# EAGLE design PLLv3 (EAGLE 5.06)
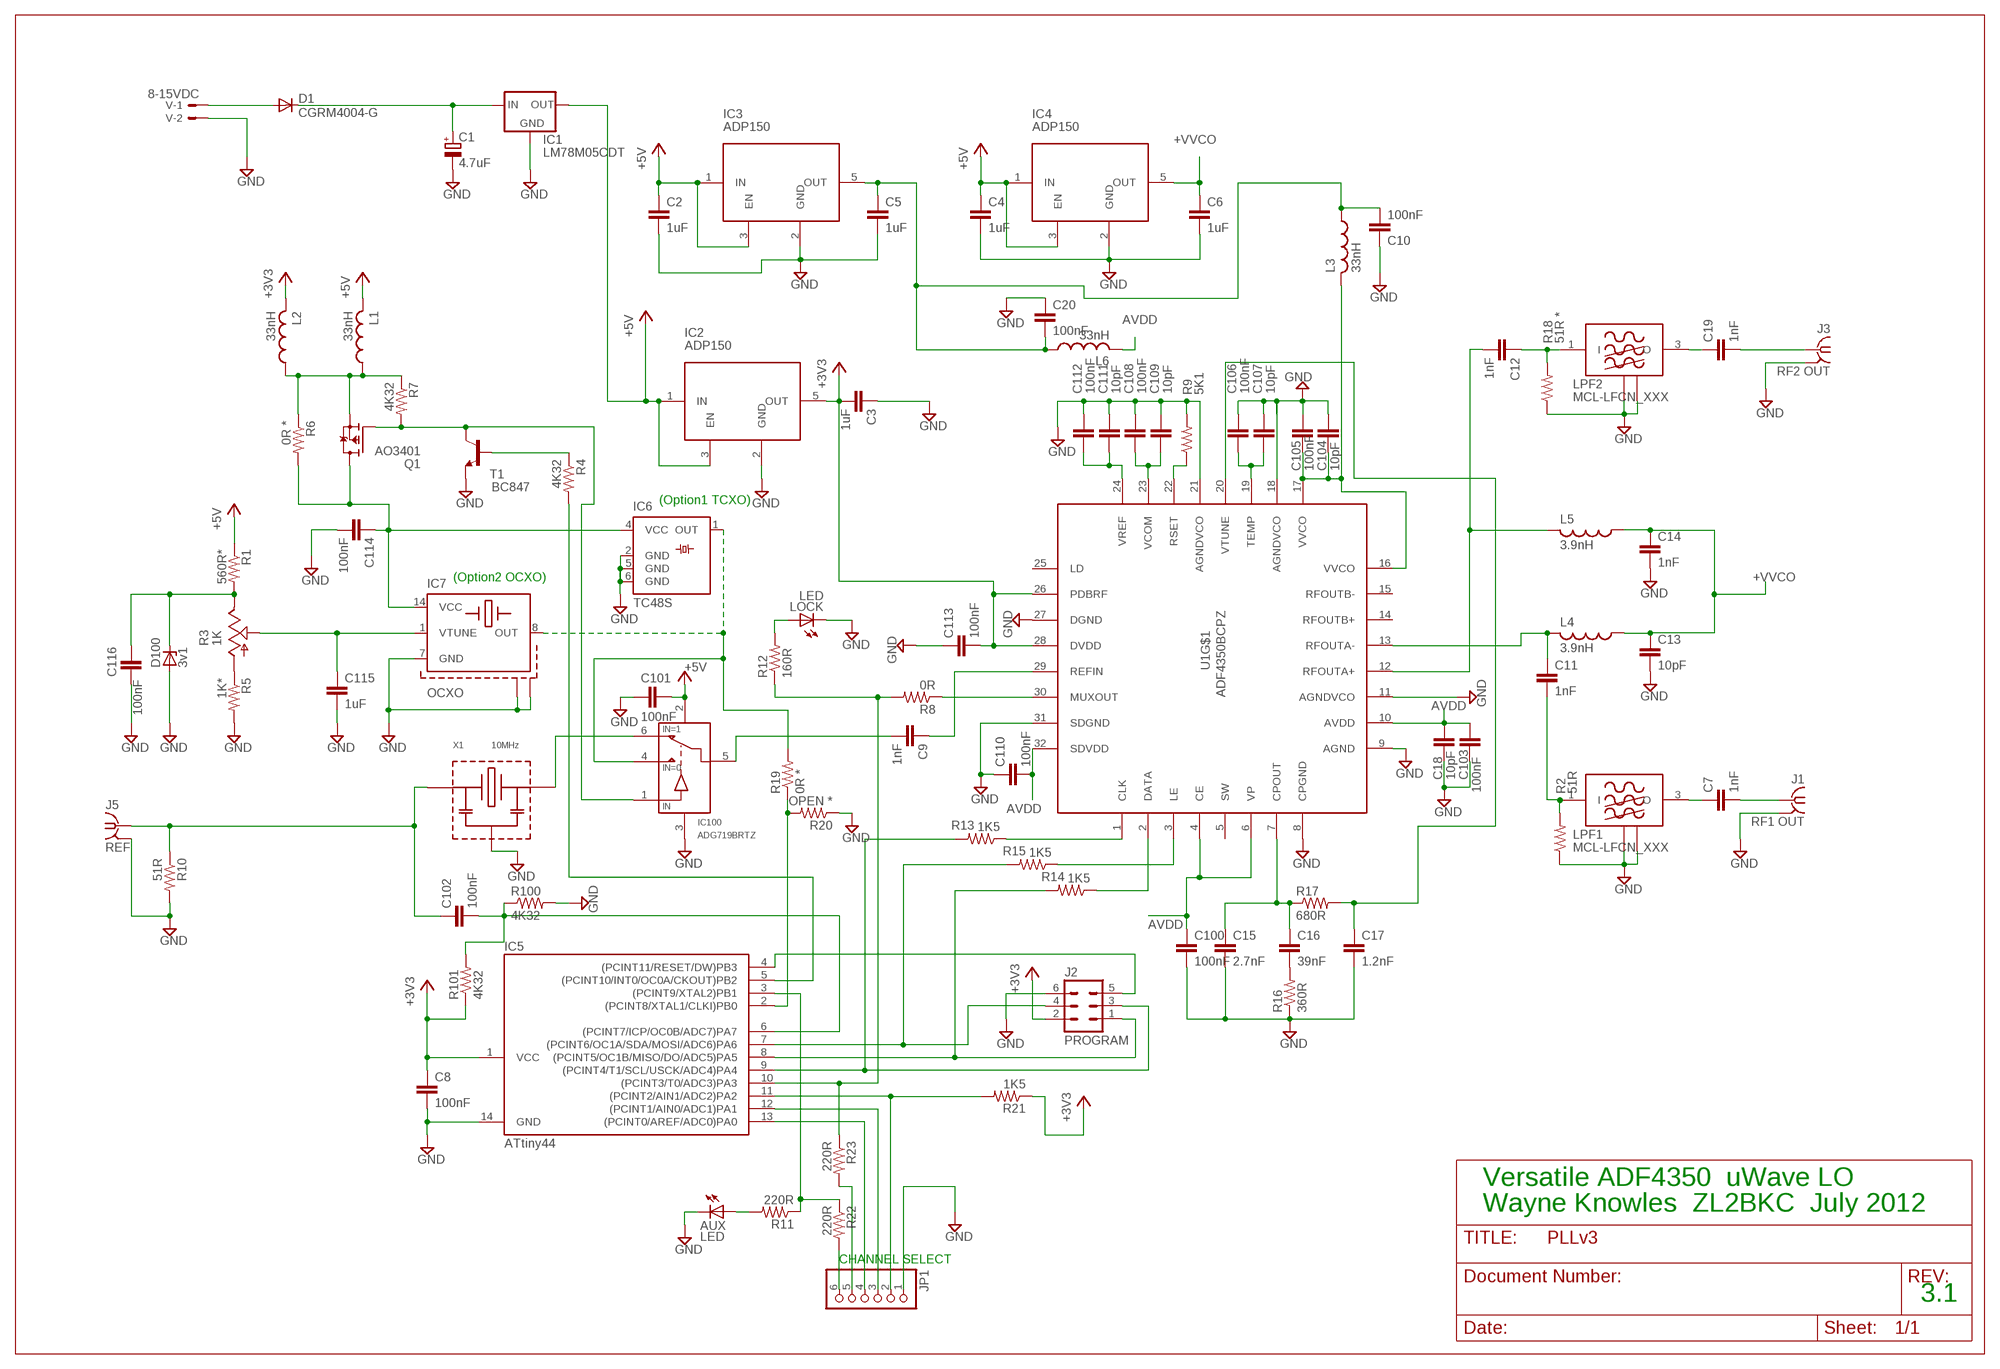
[diagram p0: schematic, sheet 1]

## Parts
AUX  LED  LEDSMT1206  [1206]
C1  4.7uF  CPOL-EUCT3528  [CT3528]
C2  1uF  C-EUC0603  [C0603]
C3  1uF  C-EUC0603  [C0603]
C4  1uF  C-EUC0603  [C0603]
C5  1uF  C-EUC0603  [C0603]
C6  1uF  C-EUC0603  [C0603]
C7  1nF  C-EUC0603  [C0603]
C8  100nF  C-EUC0603  [C0603]
C9  1nF  C-EUC0603  [C0603]
C10  100nF  C-EUC0603  [C0603]
C11  1nF  C-EUC0603  [C0603]
C12  1nF  C-EUC0603  [C0603]
C13  10pF  C-EUC0603  [C0603]
C14  1nF  C-EUC0603  [C0603]
C15  2.7nF  C-EUC0603  [C0603]
C16  39nF  C-EUC0603  [C0603]
C17  1.2nF  C-EUC0603  [C0603]
C18  10pF  C-EUC0603  [C0603]
C19  1nF  C-EUC0603  [C0603]
C20  100nF  C-EUC0603  [C0603]
C100  100nF  C-EUC0603  [C0603]
C101  100nF  C-EUC0603  [C0603]
C102  100nF  C-EUC0603  [C0603]
C103  100nF  C-EUC0603  [C0603]
C104  10pF  C-EUC0603  [C0603]
C105  100nF  C-EUC0603  [C0603]
C106  100nF  C-EUC0603  [C0603]
C107  10pF  C-EUC0603  [C0603]
C108  100nF  C-EUC0603  [C0603]
C109  10pF  C-EUC0603  [C0603]
C110  100nF  C-EUC0603  [C0603]
C111  10pF  C-EUC0603  [C0603]
C112  100nF  C-EUC0603  [C0603]
C113  100nF  C-EUC0603  [C0603]
C114  100nF  C-EUC0603  [C0603]
C115  1uF  C-EUC0603  [C0603]
C116  100nF  C-EUC0603  [C0603]
D1  CGRM4004-G  [SOD-123_MINI-SMA]
D100  3v1  ZENER-DIODESOD80C  [SOD80C]
IC1  LM78M05CDT  [DPACK]
IC2  ADP150  [SOT23-5L]
IC3  ADP150  [SOT23-5L]
IC4  ADP150  [SOT23-5L]
IC5  ATtiny44  ATTINY24/44/84-SSU  [SOIC14]
IC6  TC48S  [TC48]
IC7  OCXO  [TC46]
IC100  ADG719BRTZ  ADG7XX  [SOT23-6]
J1  RF1 OUT  SMA-142-0711-821/826  [J502-ND-142-0711-821/826]
J2  PROGRAM  MA03-2  [MA03-2]
J3  RF2 OUT  SMA-142-0711-821/826  [J502-ND-142-0711-821/826]
J5  REF  SMA-142-0711-821/826  [J502-ND-142-0711-821/826]
JP1  PINHD-1X6  [1X06]
L1  33nH  L-USL2012C  [L2012C]
L2  33nH  L-USL2012C  [L2012C]
L3  33nH  L-USL2012C  [L2012C]
L4  3.9nH  L-USL2012C  [L2012C]
L5  3.9nH  L-USL2012C  [L2012C]
L6  33nH  L-USL2012C  [L2012C]
LOCK  LED  LEDSMT1206  [1206]
LPF1  MCL-LFCN_XXX  [MCL-PL-137]
LPF2  MCL-LFCN_XXX  [MCL-PL-137]
Q1  AO3401  [SOT23]
R1  560R*  R-US_R0805  [R0805]
R2  51R  R-US_R0603  [R0603]
R3  1K  TRIM_US-S64W  [S64W]
R4  4K32  R-US_R0805  [R0805]
R5  1K*  R-US_R0805  [R0805]
R6  0R *  R-US_R0805  [R0805]
R7  4K32  R-US_R0805  [R0805]
R8  0R  R-US_R0603  [R0603]
R9  5K1  R-US_R0603  [R0603]
R10  51R  R-US_R0805  [R0805]
R11  220R  R-US_R0805  [R0805]
R12  160R  R-US_R0805  [R0805]
R13  1K5  R-US_R0603  [R0603]
R14  1K5  R-US_R0603  [R0603]
R15  1K5  R-US_R0603  [R0603]
R16  360R  R-US_R0603  [R0603]
R17  680R  R-US_R0603  [R0603]
R18  51R *  R-US_R0603  [R0603]
R19  0R *  R-US_R0603  [R0603]
R20  OPEN *  R-US_R0603  [R0603]
R21  1K5  R-US_R0805  [R0805]
R22  220R  R-US_R0805  [R0805]
R23  220R  R-US_R0805  [R0805]
R100  4K32  R-US_R0805  [R0805]
R101  4K32  R-US_R0805  [R0805]
T1  BC847  [SOT23]
U1  ADF4350BCPZ  [QFN50P500X500X100-33V2N]
V  8-15VDC  22-23-2021  [22-23-2021]
X1  10MHz  CSTCE_G15C  [CSTCE_G15C]

## Nets
+3V3: C3.2 C8.1 C113.2 IC2.5(OUT) IC5.1(VCC) J2.2 L2.2 R21.1 R101.1 U1.26(PDBRF) U1.28(DVDD)
+5V: C2.1 C4.1 C101.1 IC1.3(OUT) IC2.1(IN) IC2.3(EN) IC3.1(IN) IC3.3(EN) IC4.1(IN) IC4.3(EN) IC100.2(VDD) L1.2 R1.1
+VVCO: C6.1 C13.1 C14.1 IC4.5(OUT) L4.1 L5.1
AVDD: C18.1 C100.1 C103.1 C110.2 L6.2 U1.4(CE) U1.6(VP) U1.10(AVDD) U1.32(SDVDD)
GND: AUX.C C1.- C2.2 C3.1 C4.2 C5.2 C6.2 C8.2 C10.1 C13.2 C14.2 C15.2 C17.2 C18.2 C20.1 C100.2 C101.2 C103.2 C104.1 C105.1 C106.1 C107.1 C108.1 C109.1 C110.1 C111.1 C112.1 C113.1 C114.2 C115.2 C116.2 D100.A IC1.4(GND) IC2.2(GND) IC3.2(GND) IC4.2(GND) IC5.14(GND) IC6.2(GND) IC6.5(GND) IC6.6(GND) IC7.7(GND) IC7.GND@1(GND) IC7.GND@2(GND) IC100.3(GND) J1.G@1(GND) J2.6 J3.G@1(GND) J5.G@1(GND) JP1.1 LOCK.C LPF1.2(GND) LPF1.4(GND) LPF2.2(GND) LPF2.4(GND) R2.1 R5.2 R9.2 R10.2 R16.1 R18.1 R20.1 R100.2 T1.2(E) U1.8(CPGND) U1.9(AGND) U1.11(AGNDVCO) U1.18(AGNDVCO) U1.21(AGNDVCO) U1.27(DGND) U1.31(SDGND) V.2 X1.P2
N99: IC5.5((PCINT10/INT0/OC0A/CKOUT)PB2) R4.2
N99A: IC100.1(IN) Q1.1(G) R7.2 T1.3(C)
N$1: LOCK.A R12.2
N$2: IC5.2((PCINT8/XTAL1/CLKI)PB0) R19.1 R20.2
N$3: IC5.4((PCINT11/RESET/DW)PB3) J2.5
N$4: R9.1 U1.22(RSET)
N$5: IC5.13((PCINT0/AREF/ADC0)PA0) JP1.4
N$6: IC5.12((PCINT1/AIN0/ADC1)PA1) JP1.3
N$7: IC5.11((PCINT2/AIN1/ADC2)PA2) JP1.2 R21.2
N$8: R13.1 U1.1(CLK)
N$9: R4.1 T1.1(B)
N$10: C12.1 LPF2.1(I) R18.2
N$11: C7.1 LPF1.3(O)
N$12: R8.1 U1.30(MUXOUT)
N$13: L1.1 L2.1 Q1.2(S) R6.1 R7.1
N$14: IC5.7((PCINT6/OC1A/SDA/MOSI/ADC6)PA6) J2.4 R15.2
N$15: C16.2 R16.2
N$16: C11.2 LPF1.1(I) R2.2
N$17: C19.1 LPF2.3(O)
N$18: C15.1 C16.1 R17.1 U1.7(CPOUT)
N$19: C1.+ D1.C IC1.1(IN)
N$20: C116.1 D100.C R1.2 R3.E
N$21: R3.A R5.1
N$22: C114.1 IC6.4(VCC) IC7.14(VCC) Q1.3(D) R6.2
N$23: C115.1 IC7.1(VTUNE) R3.S
N$24: IC5.8((PCINT5/OC1B/MISO/DO/ADC5)PA5) J2.1 R14.2
N$25: IC100.6(S2) X1.P3
N$26: R15.1 U1.3(LE)
N$27: C17.1 R17.2 U1.20(VTUNE)
N$28: C19.2 J3.1
N$29: C7.2 J1.1
N$30: C9.2 IC100.5(D)
N$31: C9.1 U1.29(REFIN)
N$32: JP1.6 R22.2
N$33: JP1.5 R23.2
N$36: C111.2 C112.2 U1.24(VREF)
N$37: C108.2 C109.2 U1.23(VCOM)
N$38: AUX.A R11.2
N$39: C106.2 C107.2 U1.19(TEMP)
N$40: R14.1 U1.2(DATA)
N$42: IC5.10((PCINT3/T0/ADC3)PA3) R8.2 R12.1 R23.1
N$43: IC6.1(OUT) IC7.8(OUT) IC100.4(S1) R19.2
N$49: IC5.9((PCINT4/T1/SCL/USCK/ADC4)PA4) J2.3 R13.2
N$54: IC5.3((PCINT9/XTAL2)PB1) R11.1 R22.1
N$56: D1.A V.1
N$57: C102.2 IC5.6((PCINT7/ICP/OC0B/ADC7)PA7) R100.1 R101.2
N$58: C102.1 J5.1 R10.1 X1.P1
N$61: C104.2 C105.2 L3.2 U1.16(VVCO) U1.17(VVCO)
N$62: C5.1 C10.2 C20.2 IC3.5(OUT) L3.1 L6.1
RFOUTA+: C12.2 L5.2 U1.12(RFOUTA+)
RFOUTA-: C11.1 L4.2 U1.13(RFOUTA-)
Unconnected: IC2.4(NC) IC3.4(NC) IC4.4(NC) U1.5(SW) U1.14(RFOUTB+) U1.15(RFOUTB-) U1.25(LD)

## Notes on the sheet
- (Option1 TCXO)
- (Option2 OCXO)
- Versatile ADF4350  uWave LO
- Wayne Knowles  ZL2BKC  July 2012
- CHANNEL SELECT
- 3.1

## Power pins joined to a net without a drawn wire
GND: J1.G@2(GND) J1.G@3(GND) J1.G@4(GND) J3.G@2(GND) J3.G@3(GND) J3.G@4(GND) J5.G@2(GND) J5.G@3(GND) J5.G@4(GND) U1.PAD@1_1(GND) U1.PAD@1_2(GND) U1.PAD@1_3(GND) U1.PAD@2_1(GND) U1.PAD@2_2(GND) U1.PAD@2_3(GND) U1.PAD@3_1(GND) U1.PAD@3_2(GND) U1.PAD@3_3(GND)

## Library data of the parts
AUX LOCK = led:LED: LED OSRAM: - CHIPLED LG R971, LG N971, LY N971, LG Q971, LY Q971, LO R971, LY R971 LH N974, LH R974 LS Q976, LO Q976, LY Q976 LO Q996 - Hyper CHIPLED LW Q18S LB Q993, LB Q99A, LB R99A - SideLED LS A670, LO A670, LY A670, LG A670, LP A670 LB A673, LV A673, LT A673, LW A673 LH A674 LY A675 LS A676, LA A676, LO A676, LY A676, LW A676 LS A679, LY A679, LG A679 - Hyper Micro SIDELED® LS Y876, LA Y876, LO Y876, LY Y876 LT Y87S - SmartLED LW L88C, LW L88S LB L89C, LB L89S, LG L890 LS L89K, LO L89K, LY L89K LS L896, LA L896, LO L896, LY L896 - TOPLED LS T670, LO T670, LY T670, LG T670, LP T670 LSG T670, LSP T670, LSY T670, LOP T670, LYG T670 LG T671, LOG T671, LSG T671 LB T673, LV T673, LT T673, LW T673 LH T674 LS T676, LA T676, LO T676, LY T676, LB T676, LH T676, LSB T676, LW T676 LB T67C, LV T67C, LT T67C, LS T67K, LO T67K, LY T67K, LW E67C LS E67B, LA E67B, LO E67B, LY E67B, LB E67C, LV E67C, LT E67C LW T67C LS T679, LY T679, LG T679 LS T770, LO T770, LY T770, LG T770, LP T770 LB T773, LV T773, LT T773, LW T773 LH T774 LS E675, LA E675, LY E675, LS T675 LS T776, LA T776, LO T776, LY T776, LB T776 LHGB T686 LT T68C, LB T68C - Hyper Mini TOPLED® LB M676 - Mini TOPLED Santana® LG M470 LS M47K, LO M47K, LY M47K Source: http://www.osram.convergy.de LUXEON: - LUMILED® LXK2-PW12-R00, LXK2-PW12-S00, LXK2-PW14-U00, LXK2-PW14-V00 LXK2-PM12-R00, LXK2-PM12-S00, LXK2-PM14-U00 LXK2-PE12-Q00, LXK2-PE12-R00, LXK2-PE12-S00, LXK2-PE14-T00, LXK2-PE14-U00 LXK2-PB12-K00, LXK2-PB12-L00, LXK2-PB12-M00, LXK2-PB14-N00, LXK2-PB14-P00, LXK2-PB14-Q00 LXK2-PR12-L00, LXK2-PR12-M00, LXK2-PR14-Q00, LXK2-PR14-R00 LXK2-PD12-Q00, LXK2-PD12-R00, LXK2-PD12-S00 LXK2-PH12-R00, LXK2-PH12-S00 LXK2-PL12-P00, LXK2-PL12-Q00, LXK2-PL12-R00 Source: www.luxeon.com KINGBRIGHT: KA-3528ASYC Source: www.kingbright.com
C1 = rcl:CPOL-EU: POLARIZED CAPACITOR, European symbol
C2-C20 C100-C116 = rcl:C-EU: CAPACITOR, European symbol
D1 = diode:CGRM400*-G: Molded plasitc,JEDEC SOD-123/Mini SMA Source: Comchip CGRM4001-G.pdf
D100 = diode:ZENER-DIODE: Z-Diode
IC1 = MyComponents:LM78M*: Low drop fixed and adjustable positive voltage regulators 1 A Source: http://www.st.com/stonline/products/literature/ds/7194/ld1117axx.pdf
IC2-IC4 = @ZL2BKC_Misc:ADP150
IC5 = attiny24_44_84:ATTINY24/44/84
IC6 = crystal:TC48: Temperature Compensated Xtal Oscillator HCMOS, Clipped Sine Wave or Sine Wave Compatible Source: www.pletronics.com .. tc4.pdf
IC7 = MyComponents:OCXO
IC100 = @ZL2BKC_Misc:ADG7XX
J1 J3 J5 = con-coax:SMA-: SMA 50 Ohm End Launch Jack Receptacle - Round Contact Johnson Components Source: www.johnsoncomponents.com .. J502-ND.pdf
J2 = con-lstb:MA03-2: PIN HEADER
JP1 = pinhead:PINHD-1X6: PIN HEADER
L1-L6 = rcl:L-US: INDUCTOR, American symbol
LPF1 LPF2 = @ZL2BKC_Misc:MCL-LFCN_XXX
Q1 = ZL2BKC:AO3401
R1 R2 R4-R23 R100 R101 = rcl:R-US_: RESISTOR, American symbol
R3 = pot:TRIM_US-: POTENTIOMETER
T1 = transistor:BC847: NPN TRANSISTOR
U1 = adf4350:ADF4350
V = con-molex:22-23-2021: .100" (2.54mm) Center Header - 2 Pin
X1 = @ZL2BKC_Misc:CSTCE_G15C

## Net classes
0 default: width 0.203 mm, drill 0.305 mm, clearance 0.203 mm
1 50 Ohm: width 1.27 mm, drill 0.381 mm, clearance 1.27 mm

## Board
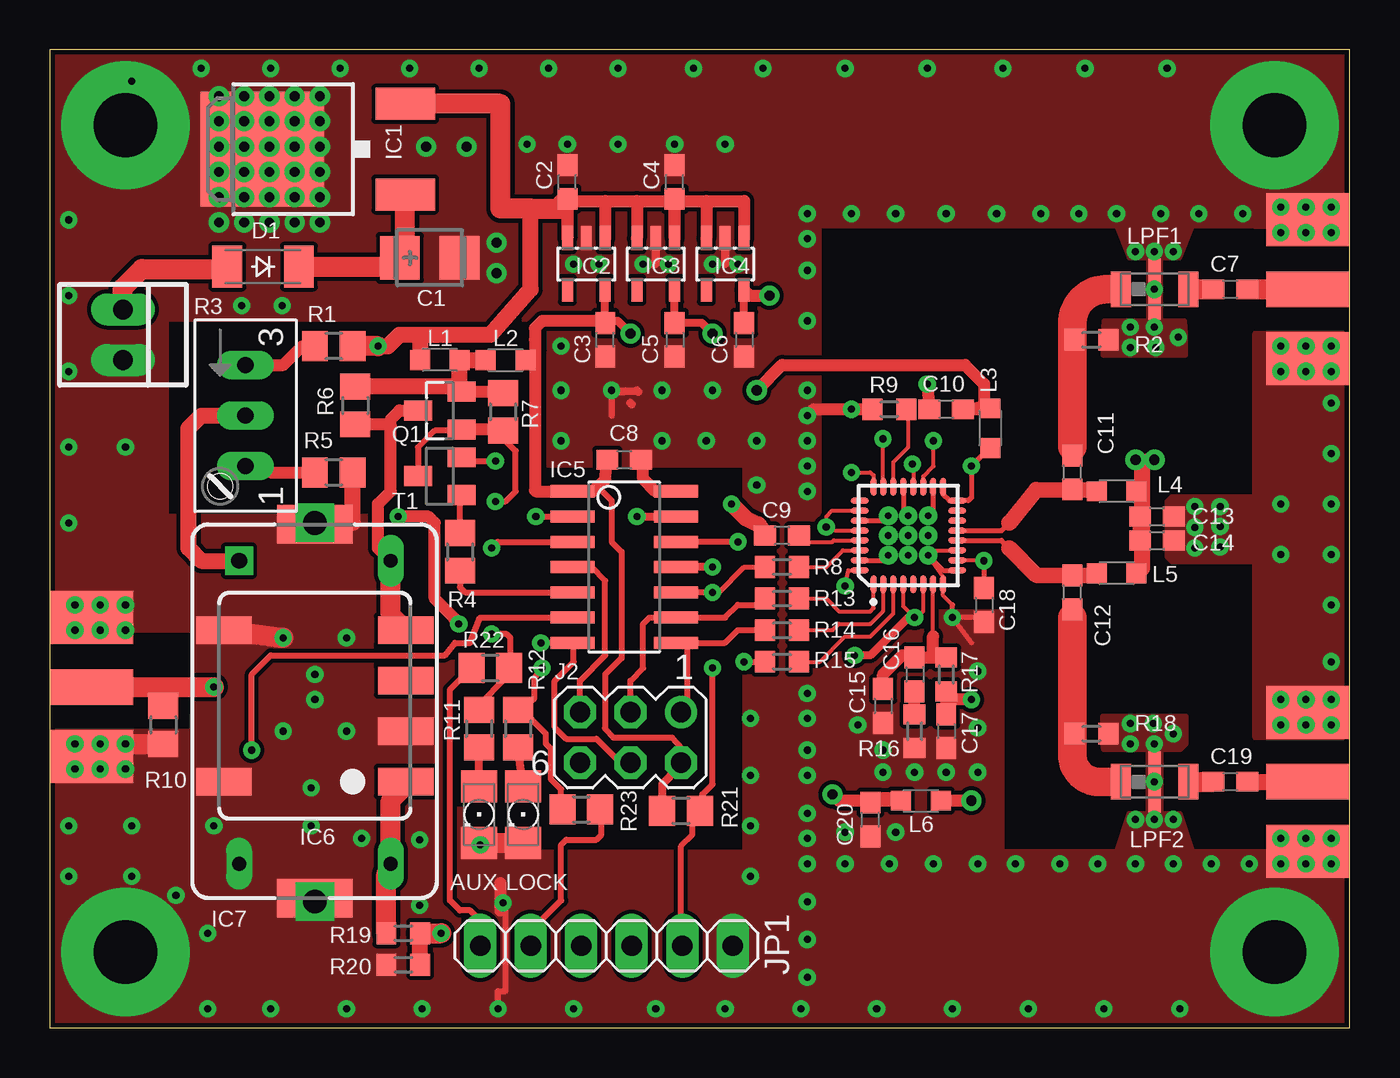
[diagram p1: board, top side]
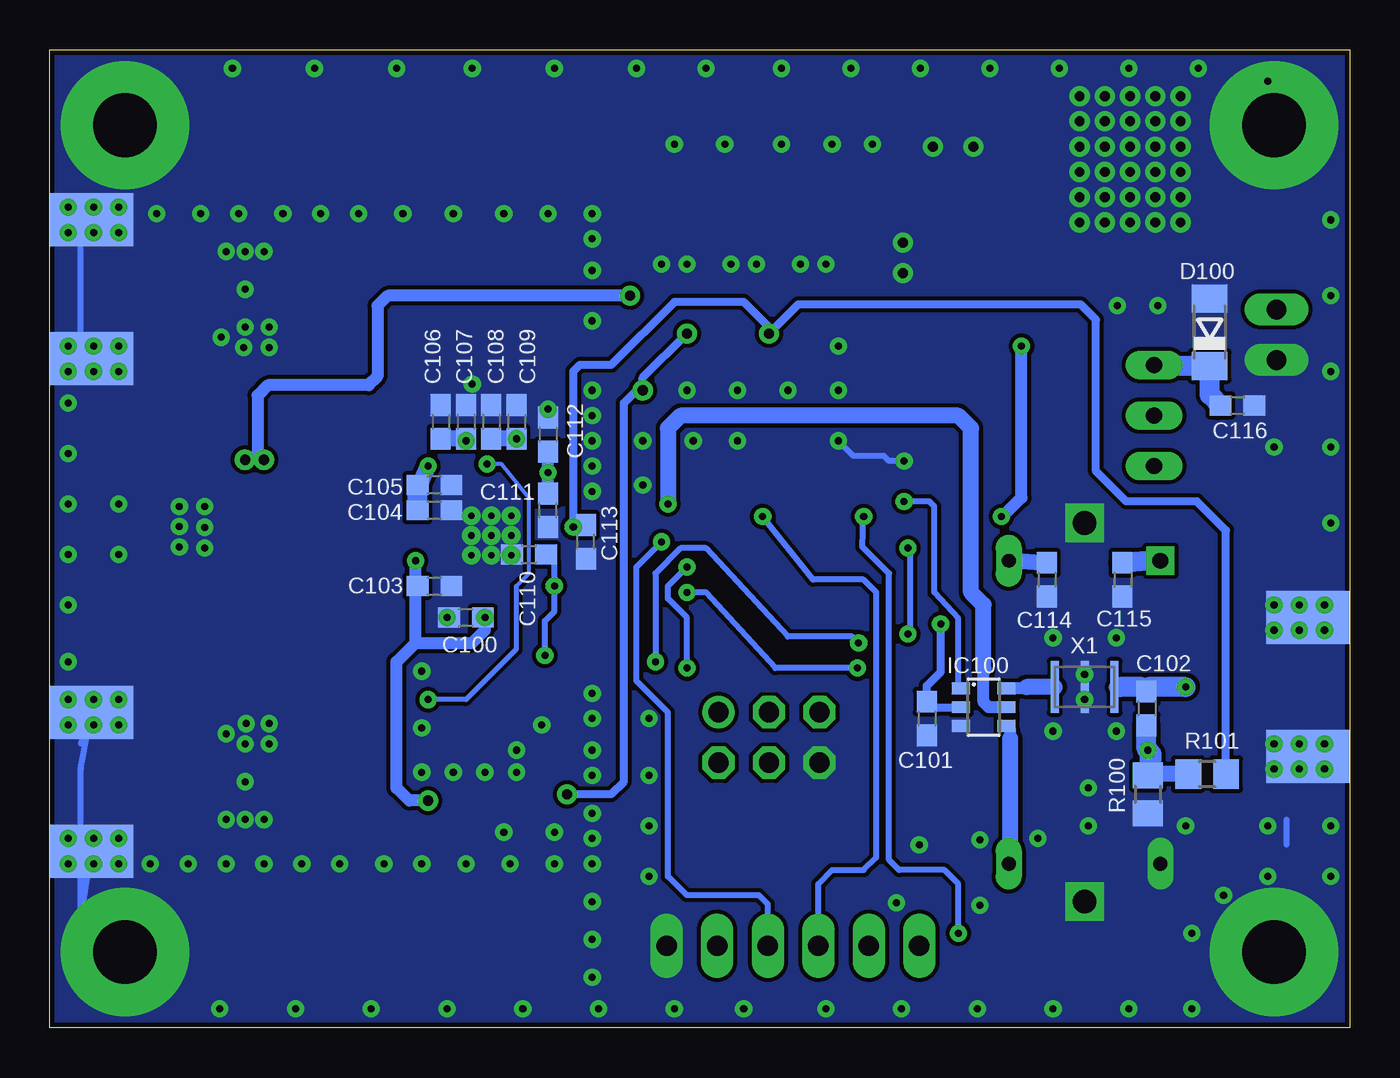
[diagram p2: board, bottom side, seen from below]

Size 65.39 x 49.2 mm. Coordinates in mm from the lower left corner, seen from the top.
Outline: 0,0 65.39,0 65.39,49.2 0,49.2 0,0
Copper layers (1*16): Top 0.035mm / dielectric 1.5mm / Bottom 0.035mm
Design rules "ZL2BKC *": minimum track width 8mil, minimum drill 12mil, track to track 8mil, track to pad 6mil, pad to pad 8mil, via to via 8mil, smd to smd 8mil, copper to edge 10mil, drill to drill 8mil, minimum pad ring 12mil, minimum via ring 10mil, stop-mask expansion 4mil, vias tented up to drill 25mil, thermal gap 10mil

### Footprints (pad centres in the part's own frame; a part is rotated, then mirrored left to right if it is on the bottom)
1206 = smd 1.6 x 1.803: A -1.422,0; C 1.422,0
CT3528 = smd 2 x 2.2: + -1.5,0; - 1.5,0
C0603 = smd 1.1 x 1: 1 -0.85,0; 2 0.85,0
SOD-123_MINI-SMA = smd 1.5 x 2.1: A 1.8,0; C -1.8,0
SOD80C = smd 1.4 x 1.8: A 1.7,0; C -1.7,0
DPACK = smd 1.6 x 3: 1 -2.28,-4.8; 3 2.28,-4.8 | smd 5.8 x 6.2: 4 0,2.38
SOT23-5L = smd 0.55 x 1.2: 1 -0.95,-1.3; 2 0,-1.3; 3 0.95,-1.3; 4 0.95,1.3; 5 -0.95,1.3
SOIC14 = smd 0.61 x 2.21: 1 -3.81,-2.603; 2 -2.54,-2.603; 3 -1.27,-2.603; 4 0,-2.603; 5 1.27,-2.603; 6 2.54,-2.603; 7 3.81,-2.603; 8 3.81,2.603; 9 2.54,2.603; 10 1.27,2.603; 11 0,2.603; 12 -1.27,2.603; 13 -2.54,2.603; 14 -3.81,2.603
TC48 = smd 2.8 x 1.4: 1 -4.57,3.81; 2 -4.57,1.27; 3 -4.57,-1.27; 4 -4.57,-3.81; 5 4.57,-3.81; 6 4.57,3.81
TC46 = drill 0.8 square: 1 -7.62,-3.81 | drill 0.7 pad 1.016 long: 7 7.62,-3.81; 8 7.62,3.81; 14 -7.62,3.81 | smd 1.93 x 3.81: GND@1 -9.45,0; GND@2 9.35,0
SOT23-6 = smd 0.6 x 0.9: 1 -0.95,-1.15; 2 0,-1.15; 3 0.95,-1.15; 4 0.95,1.15; 5 0,1.15; 6 -0.95,1.15
J502-ND-142-0711-821/826 = smd 4.191 x 1.778: 1 2.115,0 | smd 4.191 x 2.667: G@1 2.115,3.495; G@2 2.115,-3.495 | smd 4.191 x 2.667 bottom: G@3 2.115,3.495; G@4 2.115,-3.495
MA03-2 = drill 1.016 round: 1 -2.54,-1.27 | drill 1.016 octagon: 2 -2.54,1.27; 3 0,-1.27; 4 0,1.27; 5 2.54,-1.27; 6 2.54,1.27
1X06 = drill 1.016 long: 1 -6.35,0; 2 -3.81,0; 3 -1.27,0; 4 1.27,0; 5 3.81,0; 6 6.35,0
L2012C = smd 1 x 1: 1 -1,0; 2 1,0
MCL-PL-137 = smd 1 x 1.8: 1 -1.7,0; 3 1.7,0 | smd 0.635 x 1.27: 2 0,-0.9; 4 0,0.9
SOT23 = smd 1 x 1.4: 1 -0.95,-1.1; 2 0.95,-1.1; 3 0,1.1
R0805 = smd 1.3 x 1.5: 1 -0.95,0; 2 0.95,0
R0603 = smd 1 x 1.1: 1 -0.85,0; 2 0.85,0
S64W = drill 0.813 long: A 2.54,1.27; E -2.54,1.27; S 0,1.27
QFN50P500X500X100-33V2N = smd 0.9 x 0.3: 1 -2.45,1.75; 2 -2.45,1.25; 3 -2.45,0.75; 4 -2.45,0.25; 5 -2.45,-0.25; 6 -2.45,-0.75; 7 -2.45,-1.25; 8 -2.45,-1.75; 17 2.45,-1.75; 18 2.45,-1.25; 19 2.45,-0.75; 20 2.45,-0.25; 21 2.45,0.25; 22 2.45,0.75; 23 2.45,1.25; 24 2.45,1.75 | smd 0.3 x 0.9: 9 -1.75,-2.45; 10 -1.25,-2.45; 11 -0.75,-2.45; 12 -0.25,-2.45; 13 0.25,-2.45; 14 0.75,-2.45; 15 1.25,-2.45; 16 1.75,-2.45; 25 1.75,2.45; 26 1.25,2.45; 27 0.75,2.45; 28 0.25,2.45; 29 -0.25,2.45; 30 -0.75,2.45; 31 -1.25,2.45; 32 -1.75,2.45 | drill 0.33 round: PAD@1_1 -1,1; PAD@1_2 -1,0; PAD@1_3 -1,-1; PAD@2_1 0,1; PAD@2_2 0,0; PAD@2_3 0,-1; PAD@3_1 1,1; PAD@3_2 1,0; PAD@3_3 1,-1
22-23-2021 = drill 1 long: 1 -1.27,0; 2 1.27,0
CSTCE_G15C = smd 0.4 x 2.6: P1 -1.5,0; P2 0,0; P3 1.5,0

### Placement (x,y rotation side)
AUX  21.59,10.73 270 top
C1  19.11,38.73 0 top
C2  26.03,42.54 90 top
C3  27.94,34.61 90 top
C4  31.43,42.54 90 top
C5  31.43,34.61 270 top
C6  34.92,34.61 270 top
C7  59.37,37.15 0 top
C8  28.89,28.57 0 top
C9  36.83,24.76 180 top
C10  45.09,31.12 0 top
C11  51.44,27.94 90 top
C12  51.44,21.91 90 top
C13  55.69,25.72 0 top
C14  55.69,24.51 0 top
C15  41.91,16.19 270 top
C16  43.5,17.78 270 top
C17  45.09,14.92 270 top
C18  46.99,21.27 270 top
C19  59.37,12.38 0 top
C20  41.28,10.48 90 top
C100  44.45,20.64 180 bottom
C101  21.27,15.56 270 bottom
C102  10.22,16.07 270 bottom
C103  46.04,22.23 0 bottom
C104  46.04,26.04 180 bottom
C105  46.04,27.3 180 bottom
C106  45.72,30.48 270 bottom
C107  44.45,30.48 270 bottom
C108  43.18,30.48 270 bottom
C109  41.91,30.48 270 bottom
C110  41.28,23.81 0 bottom
C111  40.32,26.04 90 bottom
C112  40.32,29.84 270 bottom
C113  38.42,24.45 90 bottom
C114  15.24,22.54 270 bottom
C115  11.43,22.54 270 bottom
C116  5.65,31.31 0 bottom
D1  10.73,38.29 180 top
D100  7.05,34.99 90 bottom
IC1  13.08,44.2 90 top
IC2  26.99,38.42 180 top
IC3  30.48,38.42 180 top
IC4  33.97,38.42 180 top
IC5  28.89,23.18 270 top
IC6  13.34,16.19 180 top
IC7  13.34,15.88 270 top
IC100  18.42,16.13 270 bottom
J1  65.41,37.15 180 top
J2  29.21,14.6 180 top
J3  65.41,12.38 180 top
J5  0,17.15 0 top
JP1  28,4.13 180 top
L1  19.62,33.59 180 top
L2  22.92,33.59 0 top
L3  47.31,30.16 270 top
L4  53.66,26.99 180 top
L5  53.66,22.86 180 top
L6  43.81,11.43 0 top
LOCK  23.81,10.73 270 top
LPF1  55.56,37.15 0 top
LPF2  55.56,12.38 0 top
Q1  19.62,31.05 90 top
R1  14.29,34.29 180 top
R2  52.39,34.61 180 top
R3  8.57,30.8 270 top
R4  20.64,23.94 270 top
R5  14.29,27.94 0 top
R6  15.37,31.31 270 top
R7  22.8,30.99 270 top
R8  36.83,23.18 180 top
R9  42.23,31.12 180 top
R10  5.72,15.24 270 top
R11  21.59,15.05 270 top
R12  23.56,15.05 270 top
R13  36.83,21.59 180 top
R14  36.83,20 180 top
R15  36.83,18.41 180 top
R16  43.5,14.92 90 top
R17  45.09,17.78 270 top
R18  52.39,14.8 180 top
R19  17.78,4.76 180 top
R20  17.78,3.17 0 top
R21  31.75,10.92 0 top
R22  22.16,18.1 180 top
R23  26.73,10.99 0 top
R100  10.16,11.75 270 bottom
R101  7.18,12.76 180 bottom
T1  19.62,27.75 90 top
U1  43.18,24.76 90 top
V  3.68,34.86 270 top
X1  13.34,17.15 180 bottom

### Tracks (layer width: path | path; a pad name or v marks a point on that pad's centre or on a via)
+3V3  (via drill 0.36, 0.51)
  Top 0.203: U1.28 39.54,25.01 v39.05,25.18 39.05,25.72 39.35,26.01 U1.26
  Top 0.305: 27.55,27.22 28.26,26.52 28.26,24.45 28.77,23.94 28.77,18.61 27.93,17.79 27.93,15.07 28.35,14.61 31.3,14.61 31.81,14.03 31.81,13.4 J2.2
  Top 0.406: IC2.5 C3.2 28.02,35.56 28.58,35.56 v29.21,34.93 | 30.61,10.92 R21.1 30.8,12.26 31.56,13.02 31.43,13.02 J2.2 | L2.2 24.27,33.46 24.4,34.61
  Top 0.61: C3.2 27.86,35.56 24.76,35.56 24.4,35.2 24.4,34.61 24.4,27.04 24.45,26.99 IC5.1 27.31,26.99 | 27.31,26.99 27.94,27.57 C8.1 | 27.31,26.99 27.32,26.99 27.55,27.22
  Bottom 0.406: 38.95,25.18 C113.2 | 38.95,25.18 v39.05,25.18 | 38.95,25.18 39.05,25.08 39.05,33.02 38.73,33.34 37.15,33.34 33.97,36.51 30.48,36.51 29.21,35.24 v29.21,34.93 27.75,36.39 13.53,36.39 12.76,35.62 12.76,28 11.24,26.48 7.68,26.48 6.23,25.02 R101.1
+5V  (via drill 0.36)
  Top 0.406: IC2.3 | IC3.3 | IC3.1
  Top 0.61: v17.53,25.72 19.05,25.72 19.37,25.4 19.37,21.59 20.32,20.64 v20.57,20.32 | C2.1 IC2.3 26.04,41.59 26.03,41.59 27.94,41.59 | 27.94,41.59 29.53,41.59 | 29.53,41.59 31.43,41.59 | 31.43,41.59 33.02,41.59 | 33.02,41.59 34.92,41.59 IC4.1 | IC4.3 33.02,41.59 | C4.1 IC3.1 31.43,41.59 | IC3.3 29.53,41.59 | IC2.1 27.94,41.59
  Top 0.813: 24.19,41.21 24.19,37.15 22.16,34.86 18.61,34.86 | v16.51,34.29 17.02,34.29 17.59,34.86 18.61,34.86 | L1.2 18.62,34.85 18.61,34.86
  Top 1.016: v16.51,34.29 R1.1 | IC1.3 22.67,46.48 22.67,41.21 24.19,41.21 25.72,41.21 25.72,41.38 C2.1
  Bottom 0.406: IC100.2 20.99,16.13 C101.1 21.27,17.21 20.57,17.91 v20.57,20.32
  Bottom 0.61: v17.53,25.72 17.46,25.72 16.51,26.67 v16.51,34.29
+VVCO  (via drill 0.51)
  Top 0.406: IC4.5 C6.1
  Top 0.61: v54.61,28.57 v55.56,28.57 | v36.2,36.83 35.21,36.83 IC4.5
  Top 0.813: 54.93,26.99 54.93,23.13 L5.1 | 54.93,26.99 54.93,25.81 C13.1 C14.1 | 54.93,26.99 L4.1 | 54.93,26.99 54.93,28.26 v54.61,28.57
  Bottom 0.61: v36.2,36.83 48.39,36.83 48.89,36.32 48.89,32.77 49.34,32.32 54.42,32.32 54.93,31.81 54.93,28.89 v54.61,28.57
AVDD  (via drill 0.36, 0.51)
  Top 0.203: 46.65,23.51 U1.10 | U1.32 40.16,23.01 v40.01,22.23 | U1.4 42.93,21.2 v43.5,20.64 | U1.6 43.93,20.97 C100.1 | v43.5,20.64 C100.1 | v43.5,20.64 C100.1 | v43.5,20.64 C100.1 | v43.5,20.64 43.5,20.7
  Top 0.254: C18.1 v46.99,23.5 46.65,23.51
  Top 0.406: 43.56,20.7 43.5,20.7 43.25,20.7 41.28,18.73 v40.48,18.73
  Top 0.61: C18.1 47.07,22.23 | 44.81,11.38 L6.2 v46.36,11.43
  Bottom 0.203: v43.5,20.64 C100.1
  Bottom 0.254: 40.01,23.39 C110.2
  Bottom 0.305: 40.01,23.39 v40.01,22.23 40.01,20.95 40.48,20.48 v40.48,18.73
  Bottom 0.61: v46.36,11.43 47.31,11.43 47.94,12.07 47.94,18.42 46.99,19.37 | 46.99,19.37 44.13,19.37 43.5,20 v43.5,20.64 | 46.99,19.37 C18.1 | C18.1 v46.99,23.5 | C18.1 C103.1
GND  (via drill 0.36, 0.5, 1.2 pad 1.93, 3.2 pad 6.45)
  Top 0.203: U1.11 44.43,24.01 U1.PAD@1_3 44.93,22.7 U1.8 44.93,21.75 45.4,21.27
  Top 0.254: U1.21 42.93,26.01 U1.PAD@3_2 | U1.PAD@2_1 41.93,25.01 | U1.31 41.93,23.51 U1.PAD@1_1 | v45.4,20.64 46.36,19.37 | v45.4,20.64 45.4,21.27 | v45.4,20.64 46.75,20.64 C18.2 | U1.18 44.43,26.01 U1.PAD@3_3 | U1.27 41.93,25.51 U1.PAD@3_1 | U1.9 44.93,23.01 U1.PAD@1_3
  Top 0.305: v28.26,32.07 28.26,30.8 | C10.1 v44.13,32.39 | 22.67,5.91 22.92,5.91 22.92,1.84 22.54,1.84 v22.54,0.95 | v22.42,28.51 20.91,28.51 T1.2
  Top 0.406: 29.59,32 29.53,32.07 28.32,32 v28.26,32.07 | 29.27,31.37 29.21,31.43 | IC3.2 30.48,38.42 v29.84,38.42 | IC4.2 33.97,38.42
  Top 0.61: C10.1 44.21,31.67 v44.13,32.39 | R9.2 38.42,31.12 v38.1,30.8 | IC5.14 30.48,26.99 29.84,27.62 29.84,28.53 C8.2 | 22.67,5.91 22.67,7.28
  Top 0.813: v13.34,25.4 15.24,25.4 R5.2
  Top 1.016: R10.2 3.18,14.29 3.17,14.29 3.17,13.65 v2.54,13.02 | IC6.5 v11.75,19.62 | AUX.C LOCK.C
  Bottom 0.254: v45.4,20.64 C100.2 | C111.1 40.42,25.18 40.64,25.4
  Bottom 0.305: 63.82,33.34 63.82,40.96 J1.G@4 | 3.17,9.21 3.17,10.48 | J3.G@1 63.82,5.4 63.82,13.02 J3.G@4 63.82,14.29 | v22.42,28.51 23.18,28.51 23.43,28.77 24.96,28.77 v25.72,29.53
  Bottom 0.406: 63.16,41.59 64.45,41.59 64.45,41.57 J1.G@4 63.16,41.59 | 63.16,41.59 61.91,41.59
  other vias: 54.61,8.25 56.52,8.25 58.42,8.25 42.23,8.25 50.8,8.25 60.33,8.25 38.1,2.54 52.7,8.25 48.58,8.25 44.45,8.25 64.45,28.89 61.91,26.35 64.45,26.35 64.45,21.27 64.45,18.41 38.1,12.7 30.8,32.07 33.34,32.07 0.95,29.21 4.13,47.62 7.62,48.26 14.61,48.26 11.11,48.26 18.1,48.26 28.58,48.26 25.08,48.26 21.59,48.26 32.39,48.26 35.88,48.26 40.01,48.26 44.13,48.26 47.94,48.26 52.07,48.26 56.2,48.26 53.66,40.96 64.45,23.81 64.45,31.43 0.95,25.4 4.13,7.62 33.02,29.53 30.8,29.53 3.81,45.4 3.81,3.81 61.6,3.81 61.6,45.4 7.94,0.95 11.11,0.95 14.92,0.95 18.73,0.95 26.35,0.95 30.48,0.95 33.97,0.95 37.78,0.95 41.59,0.95 45.4,0.95 49.21,0.95 53.02,0.95 56.83,0.95 6.35,6.67 3.81,29.21 0.95,33.02 12.32,46.86 0.95,7.62 40.01,8.25 38.1,16.83 38.1,4.45 38.1,15.56 38.1,10.79 7.94,4.76 0.95,40.64 13.14,12.06 57.59,26.23 57.59,24.13 38.1,32.07 38.1,29.53 38.1,28.26 35.24,10.16 38.1,8.25 38.1,9.52 35.24,7.62 41.91,13.97 46.67,8.25 40.01,9.84 42.55,9.84 55.88,40.96 57.79,40.96 60.01,40.96 13.14,10.16 8.26,10.16 1.27,21.27 1.27,20 3.81,21.27 3.81,20 2.54,20 2.54,21.27 3.81,14.29 3.81,13.02 2.54,14.29 1.27,14.29 1.27,13.02 38.1,26.99 57.59,25.18 61.91,16.51 63.18,16.51 64.45,16.51 64.45,15.24 63.18,15.24 61.91,15.24 61.91,8.25 63.18,8.25 64.45,8.25 64.45,9.52 63.18,9.52 61.91,9.52 61.91,33.02 63.18,33.02 64.45,33.02 64.45,34.29 63.18,34.29 61.91,34.29 61.91,41.27 63.18,41.27 64.45,41.27 64.45,40.01 63.18,40.01 61.91,40.01 18.61,9.46 14.92,19.62 11.75,14.92 13.34,16.51 14.92,14.92 0.95,10.16 0.95,36.83 4.13,10.16 40.32,31.12 26.35,38.42 27.62,38.42 31.12,38.42 33.34,38.42 34.61,38.42 51.75,40.96 49.85,40.96 47.62,40.96 45.09,40.96 42.55,40.96 40.32,40.96 38.1,40.96 38.1,38.1 38.1,39.69 38.1,35.56 38.1,13.97 35.24,15.56 35.24,12.7 25.72,32.07 25.72,34.29 35.56,29.53 35.56,27.3 61.91,23.81 38.1,6.35 45.09,12.86 46.67,12.86 46.67,15.08 46.67,17.94 43.5,12.86 40.64,15.24 55.56,39.05 54.61,39.05 56.52,39.05 54.36,35.24 55.56,35.24 56.77,34.73 55.56,37.15 55.56,10.48 54.61,10.48 56.52,10.48 56.52,14.8 55.56,14.29 54.36,14.29 55.56,12.38 26.03,44.45 31.43,44.45 28.58,44.45 33.97,44.45 41.91,12.86 13.34,17.78 13.34,6.35 11.68,36.32 9.65,36.32 54.36,34.23 55.63,34.23 54.36,15.3 55.5,15.3 11.05,46.86 20.95,44.32 9.78,46.86 9.78,45.59 13.59,46.86 15.68,9.52 18.61,6.16 22.8,6.29 58.86,26.23 58.86,25.21 58.86,24.19 21.65,9.21 11.05,45.59 12.32,45.59 13.59,45.59 9.78,44.32 9.78,43.05 9.78,41.78 11.05,41.78 12.32,41.78 13.59,41.78 13.59,43.05 13.59,44.32 12.32,44.32 11.05,44.32 11.05,43.05 12.32,43.05 8.51,46.86 8.51,45.59 8.51,44.32 8.51,43.05 8.51,41.78 8.51,40.51 9.78,40.51 11.05,40.51 12.32,40.51 13.59,40.51 22.48,39.5 22.48,37.97 24,44.45 18.92,44.32
  pour Top (no thermals): 42.86,2.22 42.86,6.03 51.44,6.03 51.44,8.89 53.98,8.89 53.98,6.03 65.72,6.03 65.72,2.22
  pour Bottom (rank 2, no thermals): 0,49.21 65.72,49.21 65.72,0 0,0
  pour Top (no thermals): 0,0 0,14.92 6.98,14.92 6.98,8.83 65.72,8.83 65.72,0
  pour Top (no thermals): 60.64,34.93 65.72,34.93 65.72,14.6 60.64,14.6
  pour Top (no thermals): 0,49.21 65.72,49.21 65.72,40.32 60.64,40.32 60.64,41.27 56.83,45.4 8.89,45.4 5.08,40.96 0,40.96
  pour Top (no thermals): 47.94,20.95 37.78,20.95 37.78,6.03 47.94,6.03
  pour Top (no thermals): 38.1,33.97 38.1,28.26 25.08,28.26 25.08,33.97
  pour Top (no thermals): 5.84,20.07 0.32,20.32 0,49.21 6.03,49.21 6.03,45.4 5.84,44.2
  pour Top (no thermals): 33.34,45.72 33.34,42.23 38.42,42.23 38.42,40.32 51.44,40.32 53.98,40.32 60.64,40.32 60.64,45.72
  pour Top (no thermals): 6.98,5.4 7.3,20 3.49,20 3.49,25.72 20.64,25.72 20.64,6.03 20.64,5.4
  pour Top (rank 2, no thermals): 38.73,5.4 38.73,33.97 34.92,33.97 34.92,5.4
  pour Top (no thermals): 59.05,6.03 60.96,8.57 65.41,8.57 65.41,5.08 59.05,5.08
  pour Top (no thermals): 25.08,45.4 25.08,29.84 38.73,29.84 38.73,45.4
  pour Top: 61.91,8.89 39.69,8.89 39.69,5.4 61.91,5.4
  pour Top (no thermals): 53.66,40.32 54.29,38.73 55.24,38.73 55.24,35.56 53.02,35.56 52.96,34.93 52.96,33.85 57.15,33.85 57.15,34.93 57.09,35.56 55.88,35.56 55.88,38.73 56.83,38.73 57.47,40.32 57.47,40.96 53.66,40.96
  pour Top (no thermals): 53.66,8.89 54.29,10.79 55.24,10.79 55.24,13.97 53.02,13.97 52.96,14.29 52.96,15.68 57.15,15.68 57.15,14.29 56.83,13.97 55.88,13.97 55.88,10.79 56.83,10.79 57.47,8.89 57.47,8.25 53.66,8.25
  pour Top (no thermals): 4.64,47.56 26.99,47.56 26.99,35.62 4.64,35.62
  pour Top (no thermals): 56.2,25.72 56.2,26.48 56.45,26.73 62.55,26.73 62.55,23.43 56.45,23.43 56.2,23.69
N99
  Top 0.305: 20.32,22.67 R4.2 20.64,22.16 20.89,21.91 IC5.5
N99A  (via drill 0.36)
  Top 0.305: T1.3 18.52,29.19 19.37,30.04 20.53,30.04 Q1.1 | v22.42,26.48 22.92,26.48 23.43,26.99 23.43,29.02 22.92,29.53 22.92,29.91 R7.2
  Top 0.61: Q1.1 22.73,30.1 R7.2
  Bottom 0.305: v22.42,26.48 21.15,26.48 20.89,26.23 20.89,21.91 19.69,20.58 19.69,17.21 IC100.1
N$1
  Top 0.406: LOCK.A R12.2
N$2  (via drill 0.36)
  Top 0.305: v24.45,25.72 IC5.2
  Top 0.813: R20.2 R19.1
  Top 1.016: R19.1 v19.68,4.76
  Bottom 0.305: v24.45,25.72 24.51,24.19 23.18,22.86 23.18,8.45 22.67,7.94 20.38,7.94 19.68,7.24 v19.68,4.76
N$3
  Top 0.305: IC5.4 27.24,23.18 27.94,22.48 27.94,18.73 26.67,17.46 J2.5
N$4
  Top 0.203: U1.22 42.43,28.46 43.18,29.21 43.18,31.01 R9.1
N$5  (via drill 0.36)
  Top 0.406: v29.53,25.72 IC5.13
  Bottom 0.305: v29.53,25.72 26.99,22.54 24.45,22.54 23.81,21.91 23.81,8.57 24.45,7.94 26.03,7.94 26.73,7.24 JP1.4
N$6  (via drill 0.36)
  Top 0.305: v34.61,24.45 IC5.12
  Bottom 0.305: v34.61,24.45 35.88,23.18 35.88,17.46 34.29,15.88 34.29,7.62 33.34,6.67 29.72,6.67 29.27,6.22 JP1.3
N$7  (via drill 0.36)
  Top 0.305: v33.34,18.1 33.34,12.26 32.83,11.75 32.83,10.99 33.02,10.92 R21.2 32.32,10.73 32.32,9.72 31.75,9.14 31.75,4.13 JP1.2
  Top 0.406: v33.34,23.18 IC5.11
  Bottom 0.305: v33.34,18.1 33.34,20.64 34.29,21.59 34.29,22.23 v33.34,23.18
N$8
  Top 0.203: U1.1 41.43,21.11 41.28,20.95 39.69,20.95 39.05,21.59 R13.1
N$9
  Top 0.305: R4.1 20.64,26.72 T1.1
N$10
  Top 0.254: 51.43,13.84 51.54,13.84 R18.2
  Top 1.016: 51.43,20.64 C12.1 | 53.53,12.38 LPF2.1
  Top 1.422: 51.43,20.64 51.43,13.84 arc90 52.64,12.38 53.53,12.38
N$11
  Top 1.016: LPF1.3 C7.1
N$12
  Top 0.203: R8.1 39.05,23.18 39.89,24.01 U1.30
N$13
  Top 0.61: Q1.2 22.73,32 R7.1
  Top 0.813: R6.1 15.39,32.28 20.19,32.28 Q1.2 20.62,32.03 L1.1 L2.1
N$14  (via drill 0.36)
  Top 0.305: 26.35,19.3 26.35,18.42 25.4,17.46 25.4,15.11 25.97,14.54 27.5,14.54 28.51,13.53 29.02,13.53 J2.4 | v34.92,18.42 R15.2 | IC5.7 v24.7,19.37
  Top 0.406: 26.35,19.3 IC5.7
  Bottom 0.305: v34.92,18.42 34.92,22.86 33.65,24.13 32.39,24.13 28.26,19.68 25.02,19.68 v24.7,19.37
N$15
  Top 0.61: R16.2 C16.2
N$16
  Top 0.254: 51.43,35.12 R2.2
  Top 0.61: C11.2 51.43,29.21
  Top 1.016: 53.28,37.15 LPF1.1
  Top 1.422: 53.28,37.15 arc90 51.43,35.56 51.43,35.12 51.43,29.21
N$17
  Top 1.016: LPF2.3 C19.1
N$18
  Top 0.203: 44.43,19.7 U1.7
  Top 0.61: C15.1 41.91,17.78 42.86,18.73 43.39,18.73 C16.1 44.45,18.63 | 44.45,18.63 R17.1 | 44.43,19.7 44.43,18.65 44.45,18.63
N$19
  Top 1.016: D1.C 17.59,38.29 17.59,38.42 17.61,38.42 C1.+ 17.88,39 IC1.1
N$20
  Top 0.61: 10.48,33.34 11.75,33.34 12.7,34.29 R1.2
  Top 1.27: R3.E 10.48,33.34
  Bottom 0.813: R3.E 9.72,33.46 | C116.1 6.63,31.18
  Bottom 1.016: C116.1 7.05,31.85 D100.C 9.79,33.29 R3.E
N$21
  Top 0.61: R5.1 11.11,27.94 10.79,28.26 10.16,28.26 R3.A
N$22
  Top 0.61: IC7.14 16.51,24.13 16.51,26.35 17.14,26.99 17.14,30.29 | 17.14,30.29 17.14,30.61 17.59,31.05 Q1.3 | R6.2 17.08,30.36 17.14,30.29
  Top 1.016: IC7.14 17.14,20.76 IC6.4
  Bottom 0.813: 17.1,23.54 C114.1
  Bottom 1.016: IC7.14 17.1,23.54
N$23
  Top 0.813: R3.S 7.62,30.8 6.98,30.16 6.98,24.13 7.62,23.5 IC7.1
  Bottom 1.016: C115.1 9.57,23.54 IC7.1
N$24
  Top 0.305: 32.07,19.37 32.07,16.51 J2.1 | 32.07,19.37 IC5.8 | 32.07,19.37 33.97,19.37 34.61,20 R14.2
N$25
  Bottom 0.61: IC100.6 16.32,17.08 16.32,17.15 16.26,17.15
  Bottom 0.813: X1.P3 16.26,17.15
N$26
  Top 0.203: U1.3 42.43,20.84 41.28,19.68 40.01,19.68 38.73,18.42 R15.1
N$27  (via drill 0.36)
  Top 0.203: 43.43,28.19 U1.20
  Top 0.254: v43.4,28.36 43.43,28.19
  Top 0.61: C17.1 R17.2 45.51,16.51 v46.36,16.51
  Bottom 0.203: v43.4,28.36 42.66,28.36 41.28,26.66 41.28,22.86 41.91,22.23
  Bottom 0.254: 41.91,22.23 41.91,19.05 44.45,16.51 v46.36,16.51
N$28
  Top 0.813: C19.2 J3.1
N$29
  Top 1.016: C7.2 J1.1
N$30  (via drill 0.36)
  Top 0.813: C9.2 35.64,25.32 35,25.64 v34.29,26.35
  Bottom 0.406: 19.68,30.8 26.03,30.8
  Bottom 0.61: IC100.5 18.16,16.13 18.42,16.38 18.42,18.03
  Bottom 0.813: v34.29,26.35 34.29,30.16 33.65,30.8 19.68,30.8 19.05,30.16 19.05,21.91 18.42,21.27 18.42,18.03
N$31
  Top 0.203: C9.1 37.95,24.51 38.1,24.45 39.37,24.45 39.44,24.51 U1.29
N$32
  Top 0.305: JP1.6 21.65,5.4 21.15,5.91 20.64,5.91 20.13,6.41 20.13,17.02 R22.2
N$33
  Top 0.305: JP1.5 24.19,4.89 25.72,6.41 25.72,9.21 25.97,9.46 27.5,9.46 27.75,9.72 27.75,10.92 R23.2
N$36  (via drill 0.36)
  Top 0.203: U1.24 41.43,27.79 41.28,27.94 v40.32,27.94
  Bottom 0.61: C112.2 v40.32,27.94 C111.2
N$37  (via drill 0.36)
  Top 0.203: 41.91,27.21 C109.2
  Top 0.254: U1.23 41.91,27.21
  Bottom 0.813: C109.2 C108.2
  other vias: 41.91,29.63
N$38
  Top 0.406: AUX.A R11.2
N$39  (via drill 0.36)
  Top 0.203: U1.19 43.93,27.74 44.45,28.26 v44.45,29.53
  Bottom 0.254: v44.45,29.53 C107.2
  Bottom 0.813: C107.2 C106.2
N$40
  Top 0.203: U1.2 41.93,20.98 41.28,20.32 39.69,20.32 39.37,20 R14.1
N$42  (via drill 0.36)
  Top 0.254: v33.34,21.91 33.65,21.91 34.92,23.18 R8.2
  Top 0.305: v33.34,21.91 IC5.10 | v24.76,18.1 24.38,17.59 24.38,16.57 R12.1 24,15.56 24.19,15.56 24.96,14.8 24.96,14.29 25.21,14.03 25.21,12.51 25.72,12 25.72,11.05 R23.1
  Bottom 0.305: v24.76,18.1 28.89,18.1 32.39,21.91 v33.34,21.91
N$43
  Top 1.016: R19.2 16.93,7.72 IC7.8 17.14,11.43 17.9,12.19 IC6.1
  Bottom 0.61: IC7.8 17.26,8.38 | 17.08,14.54 17.08,15 IC100.4
  Bottom 0.813: IC7.8 17.08,8.19 17.08,14.54
N$49
  Top 0.305: J2.3 29.21,17.46 29.84,18.1 29.84,20.32 30.16,20.64 IC5.9 33.97,20.64 34.61,21.27 35.66,21.27
  Top 0.406: 35.66,21.27 R13.2
N$54  (via drill 0.36)
  Top 0.305: IC5.3 22.54,24.45 v22.23,24.13 | R11.1 21.59,16.26 22.92,17.59 22.92,17.91 R22.1 23.18,18.16 23.18,19.62 22.99,19.81 v22.23,19.81
  Bottom 0.305: v22.23,24.13 22.1,24.13 22.1,19.94 v22.23,19.81
N$56
  Top 1.016: 8.93,37.91 D1.A 8.8,38.16 4.64,38.16 3.68,37.21 V.1
N$57  (via drill 0.36)
  Top 0.305: v10.16,13.97 10.16,17.78 11.11,18.73 19.88,18.73 20.38,19.37 21.15,19.37 21.65,20.64 IC5.6
  Bottom 0.406: v10.16,13.97
  Bottom 0.813: v10.16,13.97 R100.1 10.09,12.76 R101.2
  Bottom 1.016: C102.2 10.22,14.03 v10.16,13.97 9.97,13.78 9.97,13.53 10.04,13.46
N$58  (via drill 0.36)
  Top 1.016: J5.1 5.72,17.15 | 5.72,17.15 v8.26,17.15 | 5.72,17.15 R10.1
  Bottom 0.61: 11.56,17.15 X1.P1
  Bottom 0.813: v8.26,17.15 v8.26,17.14
  Bottom 1.016: v8.26,17.15 10.14,17.15 C102.1 10.45,17.15 11.56,17.15
N$61  (via drill 0.36)
  Top 0.254: U1.17 44.93,26.82 45.24,26.51 U1.16 46.2,26.51 46.36,26.67 v46.36,28.26 46.94,28.84 L3.2
  Bottom 0.254: C105.2 46.67,27.52
  Bottom 0.813: 46.67,27.52 v46.36,28.26
  Bottom 1.016: C104.2 C105.2
N$62  (via drill 0.51)
  Top 0.406: IC3.5 C5.1 | C5.1 31.53,35.56 | C5.1 32.81,35.46 v33.34,34.93
  Top 0.61: v35.56,32.07 36.83,33.34 46.04,33.34 46.99,32.39 46.99,31.19 C10.2 46.99,31.12 L3.1 | v39.37,11.75 39.69,11.43 L6.1 42.71,11.53 41.45,11.53 C20.2
  Bottom 0.406: v39.37,11.75 37.15,11.75 36.51,12.38 36.51,31.43 35.88,32.07 v35.56,32.07 35.56,32.7 v33.34,34.93
RFOUTA+
  Top 0.254: 48.26,24.13 47.87,24.51 U1.12
  Top 0.813: 52.66,22.78 L5.2 52.58,22.78 C12.2 49.61,22.78 48.26,24.13
RFOUTA-
  Top 0.254: 48.26,25.4 47.87,25.01 U1.13
  Top 0.813: L4.2 52.58,27.06 C11.1 49.61,27.06 48.26,25.4

### Text on the board
Document: Not Part | of PCB | Not Part | of PCB | Not Part | of PCB
tDocu: ZLPLL Local Oscillator | + | - | Rev 3.1B | May 2013 | +12v | + | RF1 | GND | 1 | RF2 | PGM | RXD | TXD | CH | GND | Wayne Knowles ZL2BKC | (C) 2011, 2012
bDocu: (C) 2012 ZL2BKC | SN